# EAGLE design teensyAdapter (EAGLE 7.4.0)
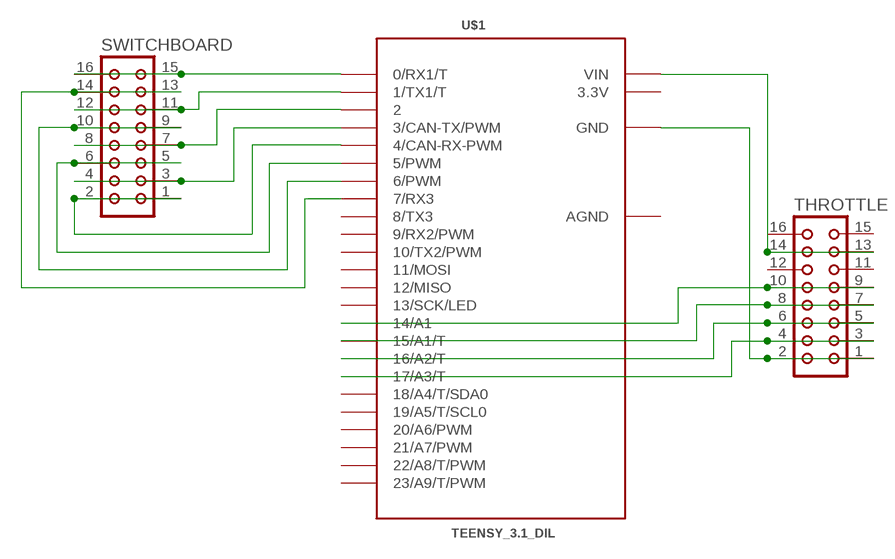
[diagram p0: schematic, sheet 1]

## Parts
SWITCHBOARD  CON16  [CON16]
THROTTLE  CON16  [CON16]
U$1  TEENSY_3.1_DIL  [TEENSY3-DIL]

## Nets
N$1: SWITCHBOARD.15 SWITCHBOARD.16 U$1.0(0/RX1/T)
N$2: SWITCHBOARD.11 SWITCHBOARD.12 U$1.1(1/TX1/T)
N$3: SWITCHBOARD.7 SWITCHBOARD.8 U$1.2
N$4: SWITCHBOARD.3 SWITCHBOARD.4 U$1.3(3/CAN-TX/PWM)
N$5: THROTTLE.13 THROTTLE.14 U$1.VIN
N$6: THROTTLE.1 THROTTLE.2 U$1.GND
N$7: SWITCHBOARD.1 SWITCHBOARD.2 U$1.4(4/CAN-RX-PWM)
N$8: SWITCHBOARD.5 SWITCHBOARD.6 U$1.5(5/PWM)
N$9: SWITCHBOARD.9 SWITCHBOARD.10 U$1.6(6/PWM)
N$10: SWITCHBOARD.13 SWITCHBOARD.14 U$1.7(7/RX3)
N$11: THROTTLE.9 THROTTLE.10 U$1.14/A0(14/A1)
N$12: THROTTLE.7 THROTTLE.8 U$1.15/A1(15/A1/T)
N$13: THROTTLE.5 THROTTLE.6 U$1.16/A2(16/A2/T)
N$14: THROTTLE.3 THROTTLE.4 U$1.17/A3(17/A3/T)
Unconnected: THROTTLE.11 THROTTLE.12 THROTTLE.15 THROTTLE.16 U$1.8(8/TX3) U$1.9(9/RX2/PWM) U$1.10(10/TX2/PWM) U$1.11(11/MOSI) U$1.12(12/MISO) U$1.13(13/SCK/LED) U$1.18/A4(18/A4/T/SDA0) U$1.19/A5(19/A5/T/SCL0) U$1.20/A6(20/A6/PWM) U$1.21/A7(21/A7/PWM) U$1.22/A8(22/A8/T/PWM) U$1.23/A9(23/A9/T/PWM)

## Power pins joined to a net without a drawn wire
3.3V: U$1.3.3V
AGND: U$1.AGND

## Library data of the parts
SWITCHBOARD THROTTLE = con-harting:CON16: CONNECTOR; OC_FARNELL: unknown; OC_NEWARK: unknown
U$1 = Teensy_3_and_LC_Series_Boards_v1.0:TEENSY_3.1_DIL: Teensy 3.1 or 3.2 in a DIL Layout.

## Board
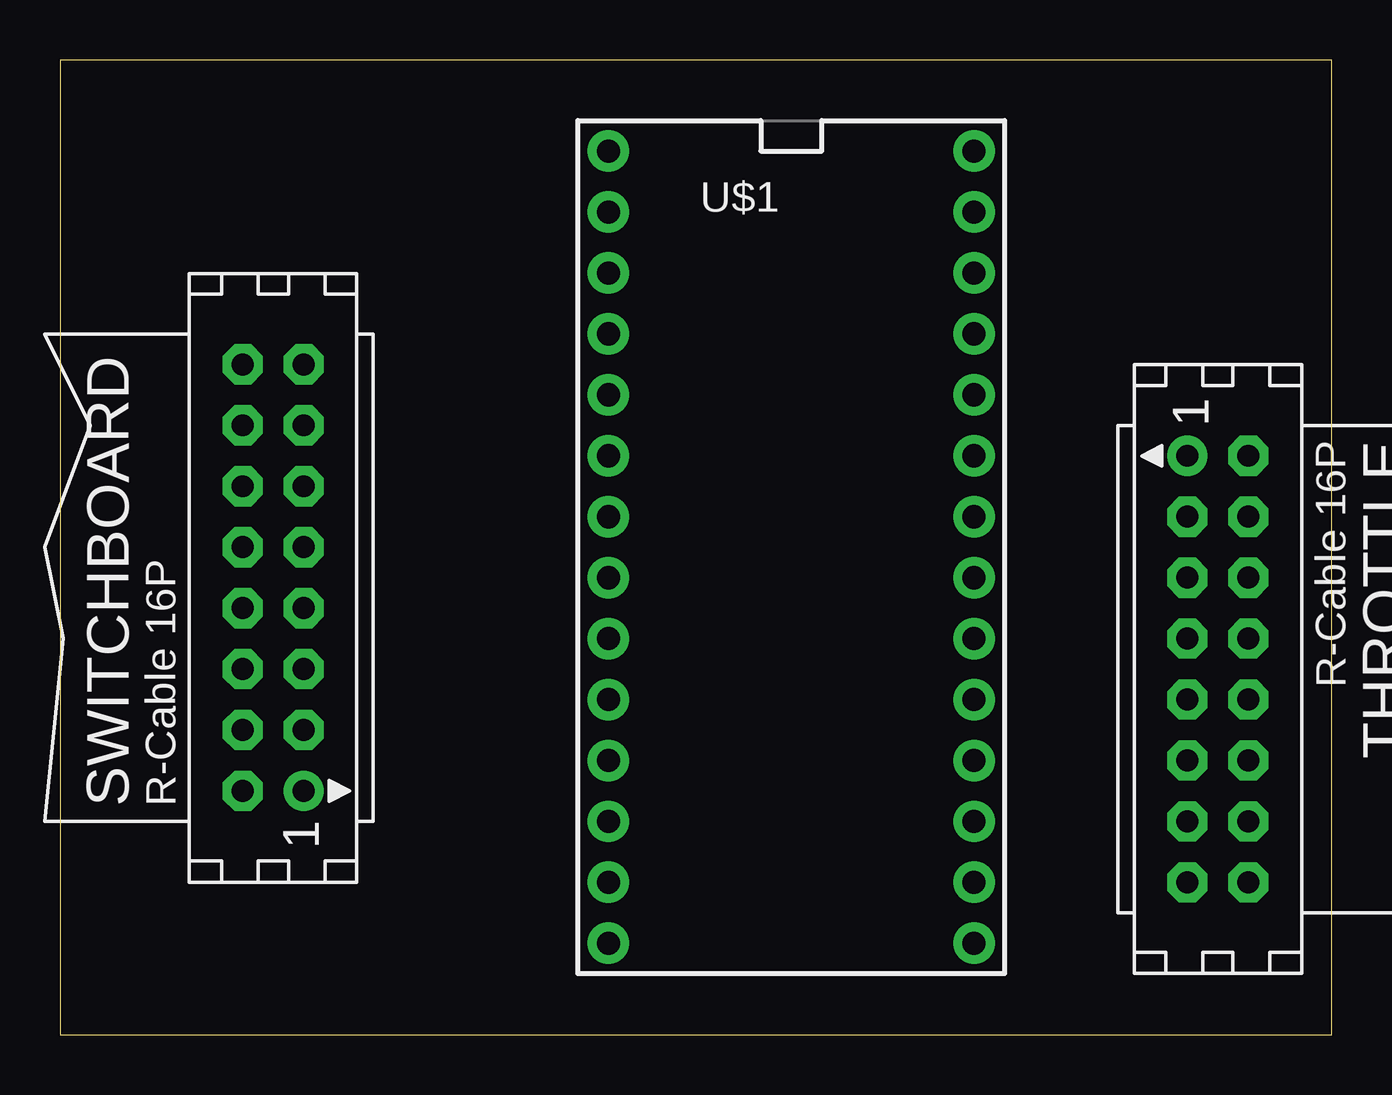
[diagram p1: board, top side]
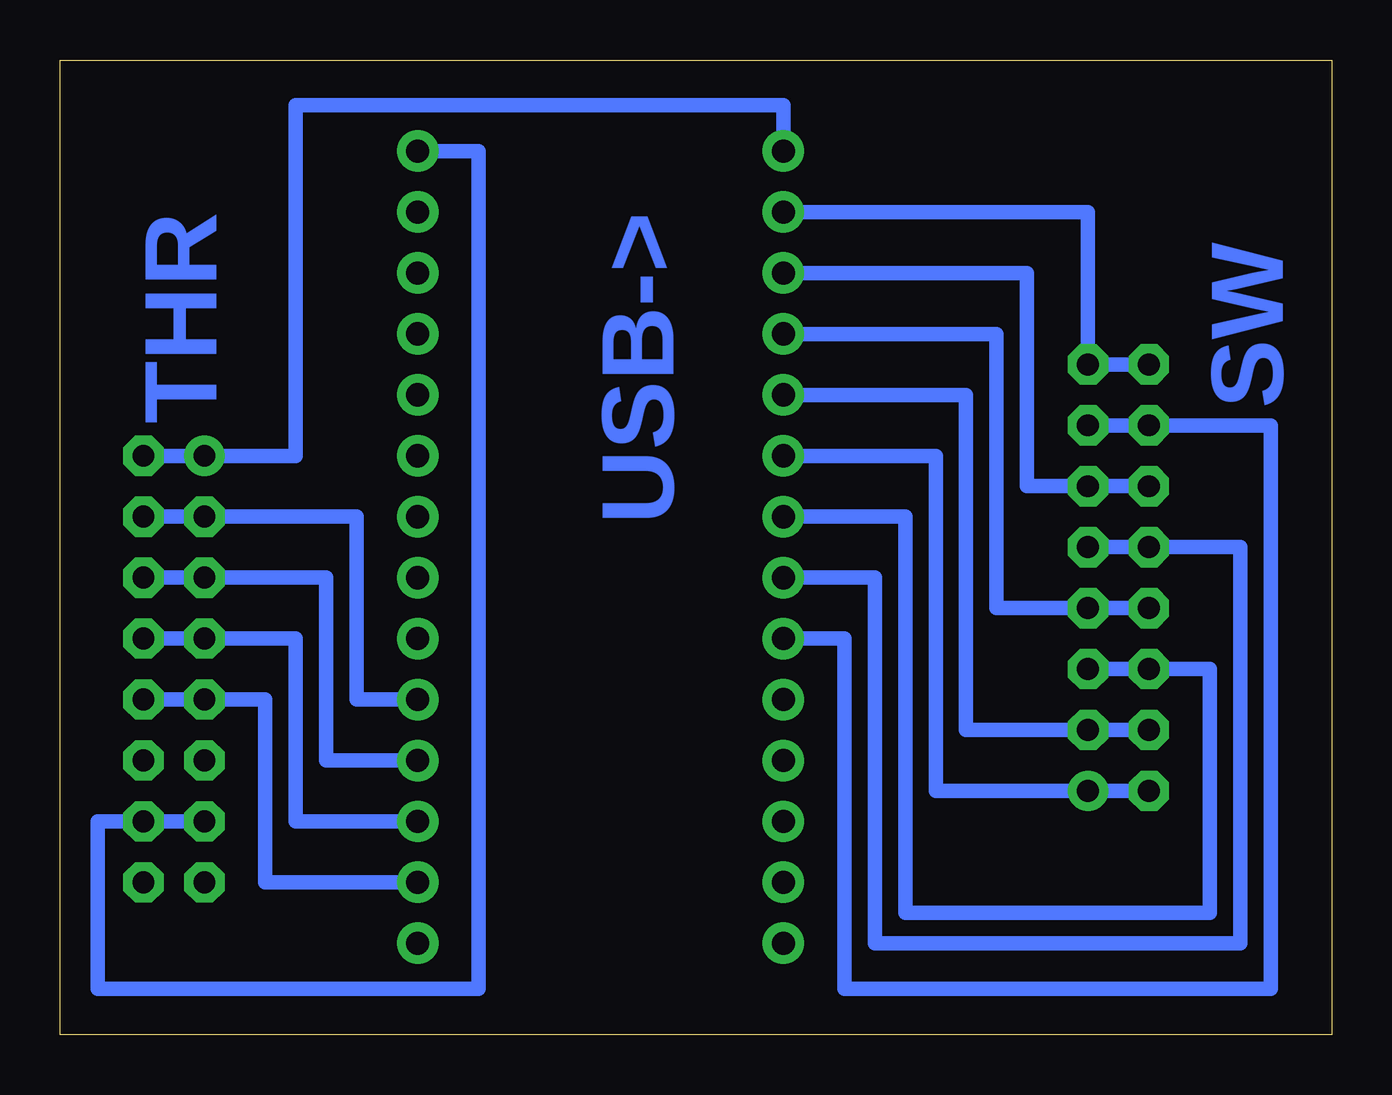
[diagram p2: board, bottom side, seen from below]

Size 53.01 x 40.63 mm. Coordinates in mm from the lower left corner, seen from the top.
Outline: 0,0 53.01,0 53.01,40.63 0,40.63 0,0
Copper layers (1*16): Top 0.035mm / dielectric 1.5mm / Bottom 0.035mm
Design rules "default *": minimum track width 15mil, minimum drill 32mil, track to track 20mil, track to pad 20mil, pad to pad 20mil, via to via 20mil, smd to smd 8mil, copper to edge 40mil, drill to drill 20mil, minimum pad ring 15mil, minimum via ring 15mil, stop-mask expansion 4mil, vias tented up to drill 0mil, thermal gap 10mil

### Footprints (pad centres in the part's own frame; a part is rotated, then mirrored left to right if it is on the bottom)
CON16 = drill 0.914: 1 -8.89,-1.27 | drill 0.914 octagon: 2 -8.89,1.27; 3 -6.35,-1.27; 4 -6.35,1.27; 5 -3.81,-1.27; 6 -3.81,1.27; 7 -1.27,-1.27; 8 -1.27,1.27; 9 1.27,-1.27; 10 1.27,1.27; 11 3.81,-1.27; 12 3.81,1.27; 13 6.35,-1.27; 14 6.35,1.27; 15 8.89,-1.27; 16 8.89,1.27
TEENSY3-DIL = drill 0.965: 0 -7.62,13.97; 1 -7.62,11.43; 2 -7.62,8.89; 3 -7.62,6.35; 3.3V 7.62,11.43; 4 -7.62,3.81; 5 -7.62,1.27; 6 -7.62,-1.27; 7 -7.62,-3.81; 8 -7.62,-6.35; 9 -7.62,-8.89; 10 -7.62,-11.43; 11 -7.62,-13.97; 12 -7.62,-16.51; 13 7.62,-16.51; 14/A0 7.62,-13.97; 15/A1 7.62,-11.43; 16/A2 7.62,-8.89; 17/A3 7.62,-6.35; 18/A4 7.62,-3.81; 19/A5 7.62,-1.27; 20/A6 7.62,1.27; 21/A7 7.62,3.81; 22/A8 7.62,6.35; 23/A9 7.62,8.89; AGND 7.62,13.97; GND -7.62,16.51; VIN 7.62,16.51

### Placement (x,y rotation side)
SWITCHBOARD  8.89,19.05 90 top
THROTTLE  48.26,15.24 270 top
U$1  30.48,20.32 0 top

### Tracks (layer width: path | path; a pad name or v marks a point on that pad's centre or on a via)
N$1
  Bottom 0.61: SWITCHBOARD.16 SWITCHBOARD.15 10.16,34.29 U$1.0
N$2
  Bottom 0.61: SWITCHBOARD.12 SWITCHBOARD.11 12.7,22.86 12.7,31.75 U$1.1
N$3
  Bottom 0.61: SWITCHBOARD.8 SWITCHBOARD.7 13.97,17.78 13.97,29.21 U$1.2
N$4
  Bottom 0.61: SWITCHBOARD.4 SWITCHBOARD.3 15.24,12.7 15.24,26.67 U$1.3
N$5
  Bottom 0.61: U$1.VIN 35.56,36.83 35.56,1.91 51.44,1.91 51.44,8.89 THROTTLE.14 THROTTLE.13
N$6
  Bottom 0.61: THROTTLE.2 THROTTLE.1 43.18,24.13 43.18,38.73 22.86,38.73 U$1.GND
N$7
  Bottom 0.61: SWITCHBOARD.1 SWITCHBOARD.2 16.51,10.16 16.51,24.13 U$1.4
N$8
  Bottom 0.61: SWITCHBOARD.5 SWITCHBOARD.6 5.08,15.24 5.08,5.08 17.78,5.08 17.78,21.59 U$1.5
N$9
  Bottom 0.61: SWITCHBOARD.9 SWITCHBOARD.10 3.81,20.32 3.81,3.81 19.05,3.81 19.05,19.05 U$1.6
N$10
  Bottom 0.61: SWITCHBOARD.13 SWITCHBOARD.14 2.54,25.4 2.54,1.91 20.32,1.91 20.32,16.51 U$1.7
N$11
  Bottom 0.61: U$1.14/A0 44.45,6.35 44.45,13.97 THROTTLE.9 THROTTLE.10
N$12
  Bottom 0.61: U$1.15/A1 43.18,8.89 43.18,16.51 THROTTLE.7 THROTTLE.8
N$13
  Bottom 0.61: U$1.16/A2 41.91,11.43 41.91,19.05 THROTTLE.5 THROTTLE.6
N$14
  Bottom 0.61: THROTTLE.4 THROTTLE.3 40.64,21.59 40.64,13.97 U$1.17/A3

### Text on the board
Bottom: USB-> | THR | SW